# Altium schematic sheet MCU.SchDoc: {Наименование}
size 209 x 297 mm; DocumentNumber: {Обозначение}; SheetNumber: {}; SheetTotal: {}; PageSetup: Record=PageOptions|CenterHorizontal=False|CenterVertical=False|PrintScale=0.99|XCorrection=0.00|YCorrection=0.00|PrintKind=1|BorderSize=5000000|LeftOffset=0|BottomOffset=0|Orientation=1|PaperLength=1000|PaperWidth=1000|Scale=100|PaperSource=15|PrintQuality=600|MediaType=1|DitherType=10|PrintScaleMode=1|PaperKind=A4; Rule: PcbType=ProtelPcb
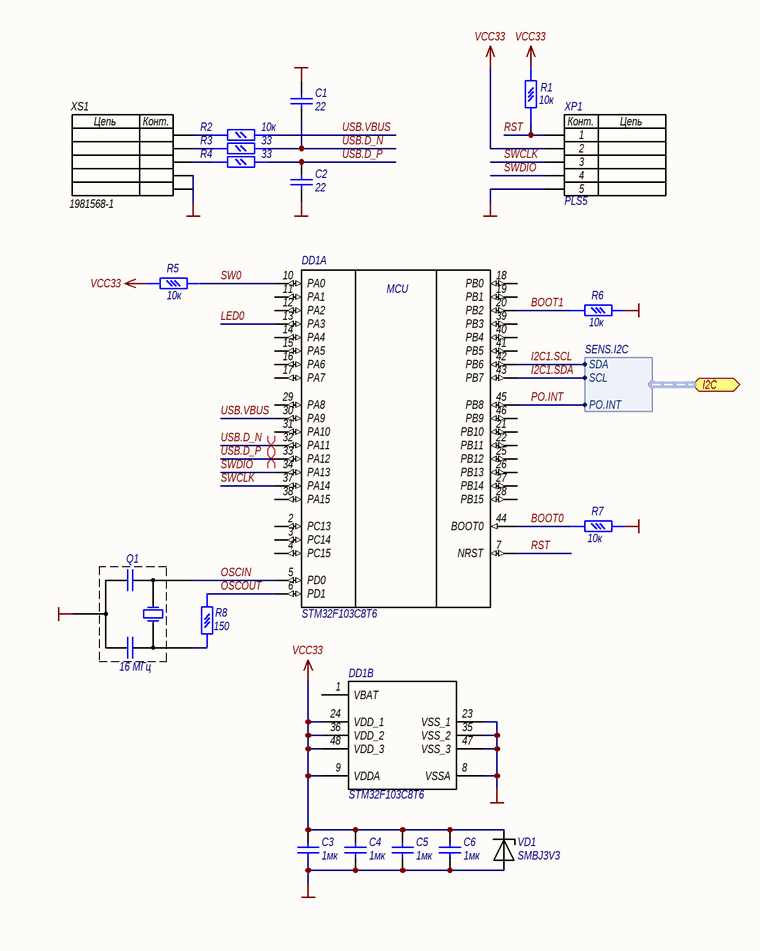
[diagram p0: MCU.SchDoc]

## Parts
C1  value 22  [CAPC2012L]  (hidden comment: CL21C220JBANNN)
C2  value 22  [CAPC2012L]  (hidden comment: CL21C220JBANNN)
C3  value 1мк  [CAPC1608L]  (hidden comment: CL10A105KO5LNN)
C4  value 1мк  [CAPC1608L]  (hidden comment: CL10A105KO5LNN)
C5  value 1мк  [CAPC1608L]  (hidden comment: CL10A105KO5LNN)
C6  value 1мк  [CAPC1608L]  (hidden comment: CL10A105KO5LNN)
DD1  STM32F103C8T6  [STM-LQFP48_N]  (parts A,B of 2)
Q1  value 16 МГц  [CSTCE_V1]  (hidden comment: CSTCE16M0V53A)
R1  value 10к  [RESC1608L]  (hidden comment: RC1608J103CS)
R2  value 10к  [RESC2012L]  (hidden comment: RC2012J103CS)
R3  value 33  [RESC2012L]  (hidden comment: RC2012J330CS)
R4  value 33  [RESC2012L]  (hidden comment: RC2012J330CS)
R5  value 10к  [RESC1608L]  (hidden comment: RC1608J103CS)
R6  value 10к  [RESC1608L]  (hidden comment: RC1608J103CS)
R7  value 10к  [RESC1608L]  (hidden comment: RC1608J103CS)
R8  value 150  [RESC1608L]  (hidden comment: RC1608J151CS)
VD1  SMBJ3V3  [SMB]
XP1  PLS5  [hdr1x5]
XS1  1981568-1  [1981568]

## Ports
I2C (harness SENS.I2C)

## Harnesses
SENS.I2C: SDA, SCL, PO.INT

## Nets
GND: C1.2 C2.2 C3.1 C4.1 C5.1 C6.1 DD1.8(VSSA) DD1.23(VSS_1) DD1.35(VSS_2) DD1.47(VSS_3) Q1.2(GND) R6.1 R7.1 VD1.2(A) XP1.5 XS1.4 XS1.5
VCC33: C3.2 C4.2 C5.2 C6.2 DD1.9(VDDA) DD1.24(VDD_1) DD1.36(VDD_2) DD1.48(VDD_3) R1.2 R5.1 VD1.1(C) XP1.2
BOOT0: DD1.44(BOOT0) R7.2
BOOT1: DD1.20(PB2) R6.2
I2C1.SCL: DD1.42(PB6) ; port I2C.SDA
I2C1.SDA: DD1.43(PB7) ; port I2C.SCL
LED0: DD1.13(PA3)
OSCIN: DD1.5(PD0) Q1.1(OSC1)
OSCOUT: DD1.6(PD1) R8.2
PO.INT: DD1.45(PB8) ; port I2C.PO.INT
RST: DD1.7(NRST) R1.1 XP1.1
SW0: DD1.10(PA0) R5.2
SWCLK: DD1.37(PA14) XP1.3
SWDIO: DD1.34(PA13) XP1.4
USB.D_N: C1.1 DD1.32(PA11) R3.2
USB.D_P: C2.1 DD1.33(PA12) R4.2
USB.VBUS: DD1.30(PA9) R2.2
NetQ1_3: Q1.3(OSC2) R8.1
NetR2_1: R2.1 XS1.1
NetR3_1: R3.1 XS1.2
NetR4_1: R4.1 XS1.3

Not connected (* = marked no-connect by the designer): DD1 1(VBAT) 2(PC13) 3(PC14) 4(PC15) 11(PA1) 12(PA2) 14(PA4) 15(PA5) 16(PA6) 17(PA7) 18(PB0) 19(PB1) 21(PB10) 22(PB11) 25(PB12) 26(PB13) 27(PB14) 28(PB15) 29(PA8) 31(PA10) 38(PA15) 39(PB3) 40(PB4) 41(PB5) 46(PB9)

## Layout directives
differential pair: USB.D_N, USB.D_P

## Notes on the sheet
- Подп. и дата
- Инв. № дубл.
- Взам. инв. №
- Инв. № подл.
- Лист
- Изм.
- № докум.
- Подп.
- Дата
- (in symbol MICRO USB B) Цепь; Конт.
- (in symbol PLS5) Конт.; Цепь
- (in symbol STM32F103C8T6, part A) MCU

## Library data of the parts
C1 C2 = CL21: Samsung General Capacitor; Power/Voltage: 25В; Rem: SMD; ТКЕ/ТКС: NP0; Tolerance: ±5%; TU/GOST: EIA CC0805; PackageReference: 0805; ManufacturerPartNumber: CL21C220JBANNN; Manufacturer: Samsung; Range: *
C3-C6 = CL10A105KO5LNN: Samsung MLCC Capacitor; Power/Voltage: 16В; Rem: SMD; Tolerance: ±10%; TU/GOST: EIA CC0603; ТКЕ/ТКС: X5R; VAL: 105; Designator: C?; Manufacturer: Samsung; ManufacturerPartNumber: CL10A105KO5LNN; PackageReference: 0603; Range: *; Part Number: CL10A105KO5LNN; Pin Count: 2; Published: 01.05.2013; Publisher: Komiss Labs.
DD1 = STM32F103C8T6: ARM Cortex-M3 32-bit MCU, 64 KB Flash, 20 KB Internal RAM, 37 I/Os, 48-pin LQFP, -40 to 85 degC, Tray; Manufacturer: STMicroelectronics; REM: SMD; ManufacturerPartNumber: STM32F103C8T6; PackageReference: LQFP48
Q1 = CSTCE16M0V53A: Murata Ceramic Resonator; Manufacturer: Murata Manufacturing Co., Ltd.; ManufacturerPartNumber: CSTCE16M0V53A; PackageReference: 3216
R1 R5-R7 = RC1608J103CS: General Thick Film Chip Resistor; Manufacturer: Samsung; Power/Voltage: 0.1Вт; Tolerance: ±5%; Rem: SMD; Check: NO; ТКЕ/ТКС: ±250ppm/°C; TU/GOST: EIA RES0603; Designator: R?; F47: 10000,0; ManufacturerPartNumber: RC1608J103CS; PackageReference: 0603; Name: RC1608J103CS; Type: Резистор; Part Number: RC1608J103CS; Pin Count: 2; Published: 01.05.2013; Publisher: Komiss Labs.
R2-R4 = RES0805: Thick Film Chip Resistor; Manufacturer: Samsung; Power/Voltage: 150В/0.125Вт; Tolerance: ±5%; Rem: SMD; Check: NO; PackageReference: 0805
  R2: ManufacturerPartNumber: RC2012J103CS
  R3 R4: ManufacturerPartNumber: RC2012J330CS
R8 = RC1608J151CS: General Thick Film Chip Resistor; Manufacturer: Samsung; Power/Voltage: 0.1Вт; Tolerance: ±5%; Rem: SMD; Check: NO; ТКЕ/ТКС: ±250ppm/°C; TU/GOST: EIA RES0603; Designator: R?; F47: 150,0; ManufacturerPartNumber: RC1608J151CS; PackageReference: 0603; Name: RC1608J151CS; Type: Резистор; Part Number: RC1608J151CS; Pin Count: 2; Published: 01.05.2013; Publisher: Komiss Labs.
VD1 = SMAJ58A: TVS UNIDIRECT 600W 3.3V SMB; Manufacturer: Diodes Inc; Type: Стабилитрон; ManufacturerPartNumber: SMBJ3V3; PackageReference: SMB(DO-214AA)
XS1 = MICRO USB B: CONN RCPT MICRO USB B R/A SMD; Manufacturer: TE Connectivity; ManufacturerPartNumber: 1981568-1; Type: Розетка